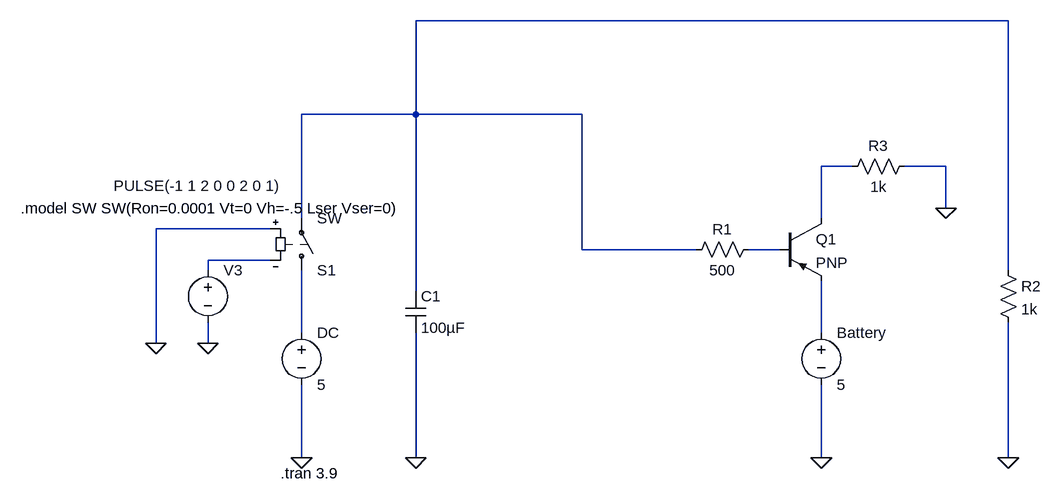
[diagram p0: schematic Power Supply v4.asc]
Power Supply v4.asc, the LTspice schematic file:
Version 4
SHEET 1 2212 680
WIRE 1184 -272 272 -272
WIRE 272 -128 272 -272
WIRE 272 -128 96 -128
WIRE 528 -128 272 -128
WIRE 944 -48 896 -48
WIRE 1088 -48 1024 -48
WIRE 1088 16 1088 -48
WIRE 96 32 96 -128
WIRE 896 32 896 -48
WIRE 48 48 -128 48
WIRE 528 80 528 -128
WIRE 704 80 528 80
WIRE 832 80 784 80
WIRE 48 96 -48 96
WIRE -48 112 -48 96
WIRE 1184 112 1184 -272
WIRE 272 144 272 -128
WIRE 96 208 96 112
WIRE 896 208 896 128
WIRE -128 224 -128 48
WIRE -48 224 -48 192
WIRE 96 400 96 288
WIRE 272 400 272 208
WIRE 896 400 896 288
WIRE 1184 400 1184 192
FLAG -128 224 0
FLAG -48 224 0
FLAG 96 400 0
FLAG 896 400 0
FLAG 272 400 0
FLAG 1184 400 0
FLAG 1088 16 0
SYMBOL voltage 96 192 R0
WINDOW 123 0 0 Left 2
WINDOW 39 0 0 Left 2
SYMATTR InstName DC
SYMATTR Value 5
SYMBOL voltage 896 192 R0
WINDOW 123 0 0 Left 2
WINDOW 39 0 0 Left 2
SYMATTR InstName Battery
SYMATTR Value 5
SYMBOL pnp 832 32 R0
SYMATTR InstName Q1
SYMBOL cap 256 144 R0
SYMATTR InstName C1
SYMATTR Value 100µF
SYMBOL res 800 64 R90
WINDOW 0 0 56 VBottom 2
WINDOW 3 32 56 VTop 2
SYMATTR InstName R1
SYMATTR Value 500
SYMBOL res 1168 96 R0
SYMATTR InstName R2
SYMATTR Value 1k
SYMBOL voltage -48 96 R0
WINDOW 3 -145 -114 Left 2
WINDOW 123 0 0 Left 2
WINDOW 39 0 0 Left 2
SYMATTR Value PULSE(-1 1 2 0 0 2 0 1)
SYMATTR InstName V3
SYMBOL sw 96 128 M180
SYMATTR InstName S1
SYMBOL res 1040 -64 R90
WINDOW 0 0 56 VBottom 2
WINDOW 3 32 56 VTop 2
SYMATTR InstName R3
SYMATTR Value 1k
TEXT 64 424 Left 2 !.tran 3.9
TEXT -336 16 Left 2 !.model SW SW(Ron=0.0001 Vt=0 Vh=-.5 Lser Vser=0)

The netlist it stands for:
* Power Supply v4.asc
V§DC N005 0 5
V§Battery N006 0 5
Q1 N002 N003 N006 0 PNP
C1 N001 0 100µF
R1 N003 N001 500
R2 N001 0 1k
V3 N004 0 PULSE(-1 1 2 0 0 2 0 1)
S1 N005 N001 0 N004 SW
R3 0 N002 1k
.model NPN NPN
.model PNP PNP
.lib standard.bjt
.tran 3.9
.model SW SW(Ron=0.0001 Vt=0 Vh=-.5 Lser Vser=0)
.backanno
.end